# EasyEDA Pro project RadioFox1.eprj, schematic Schematic
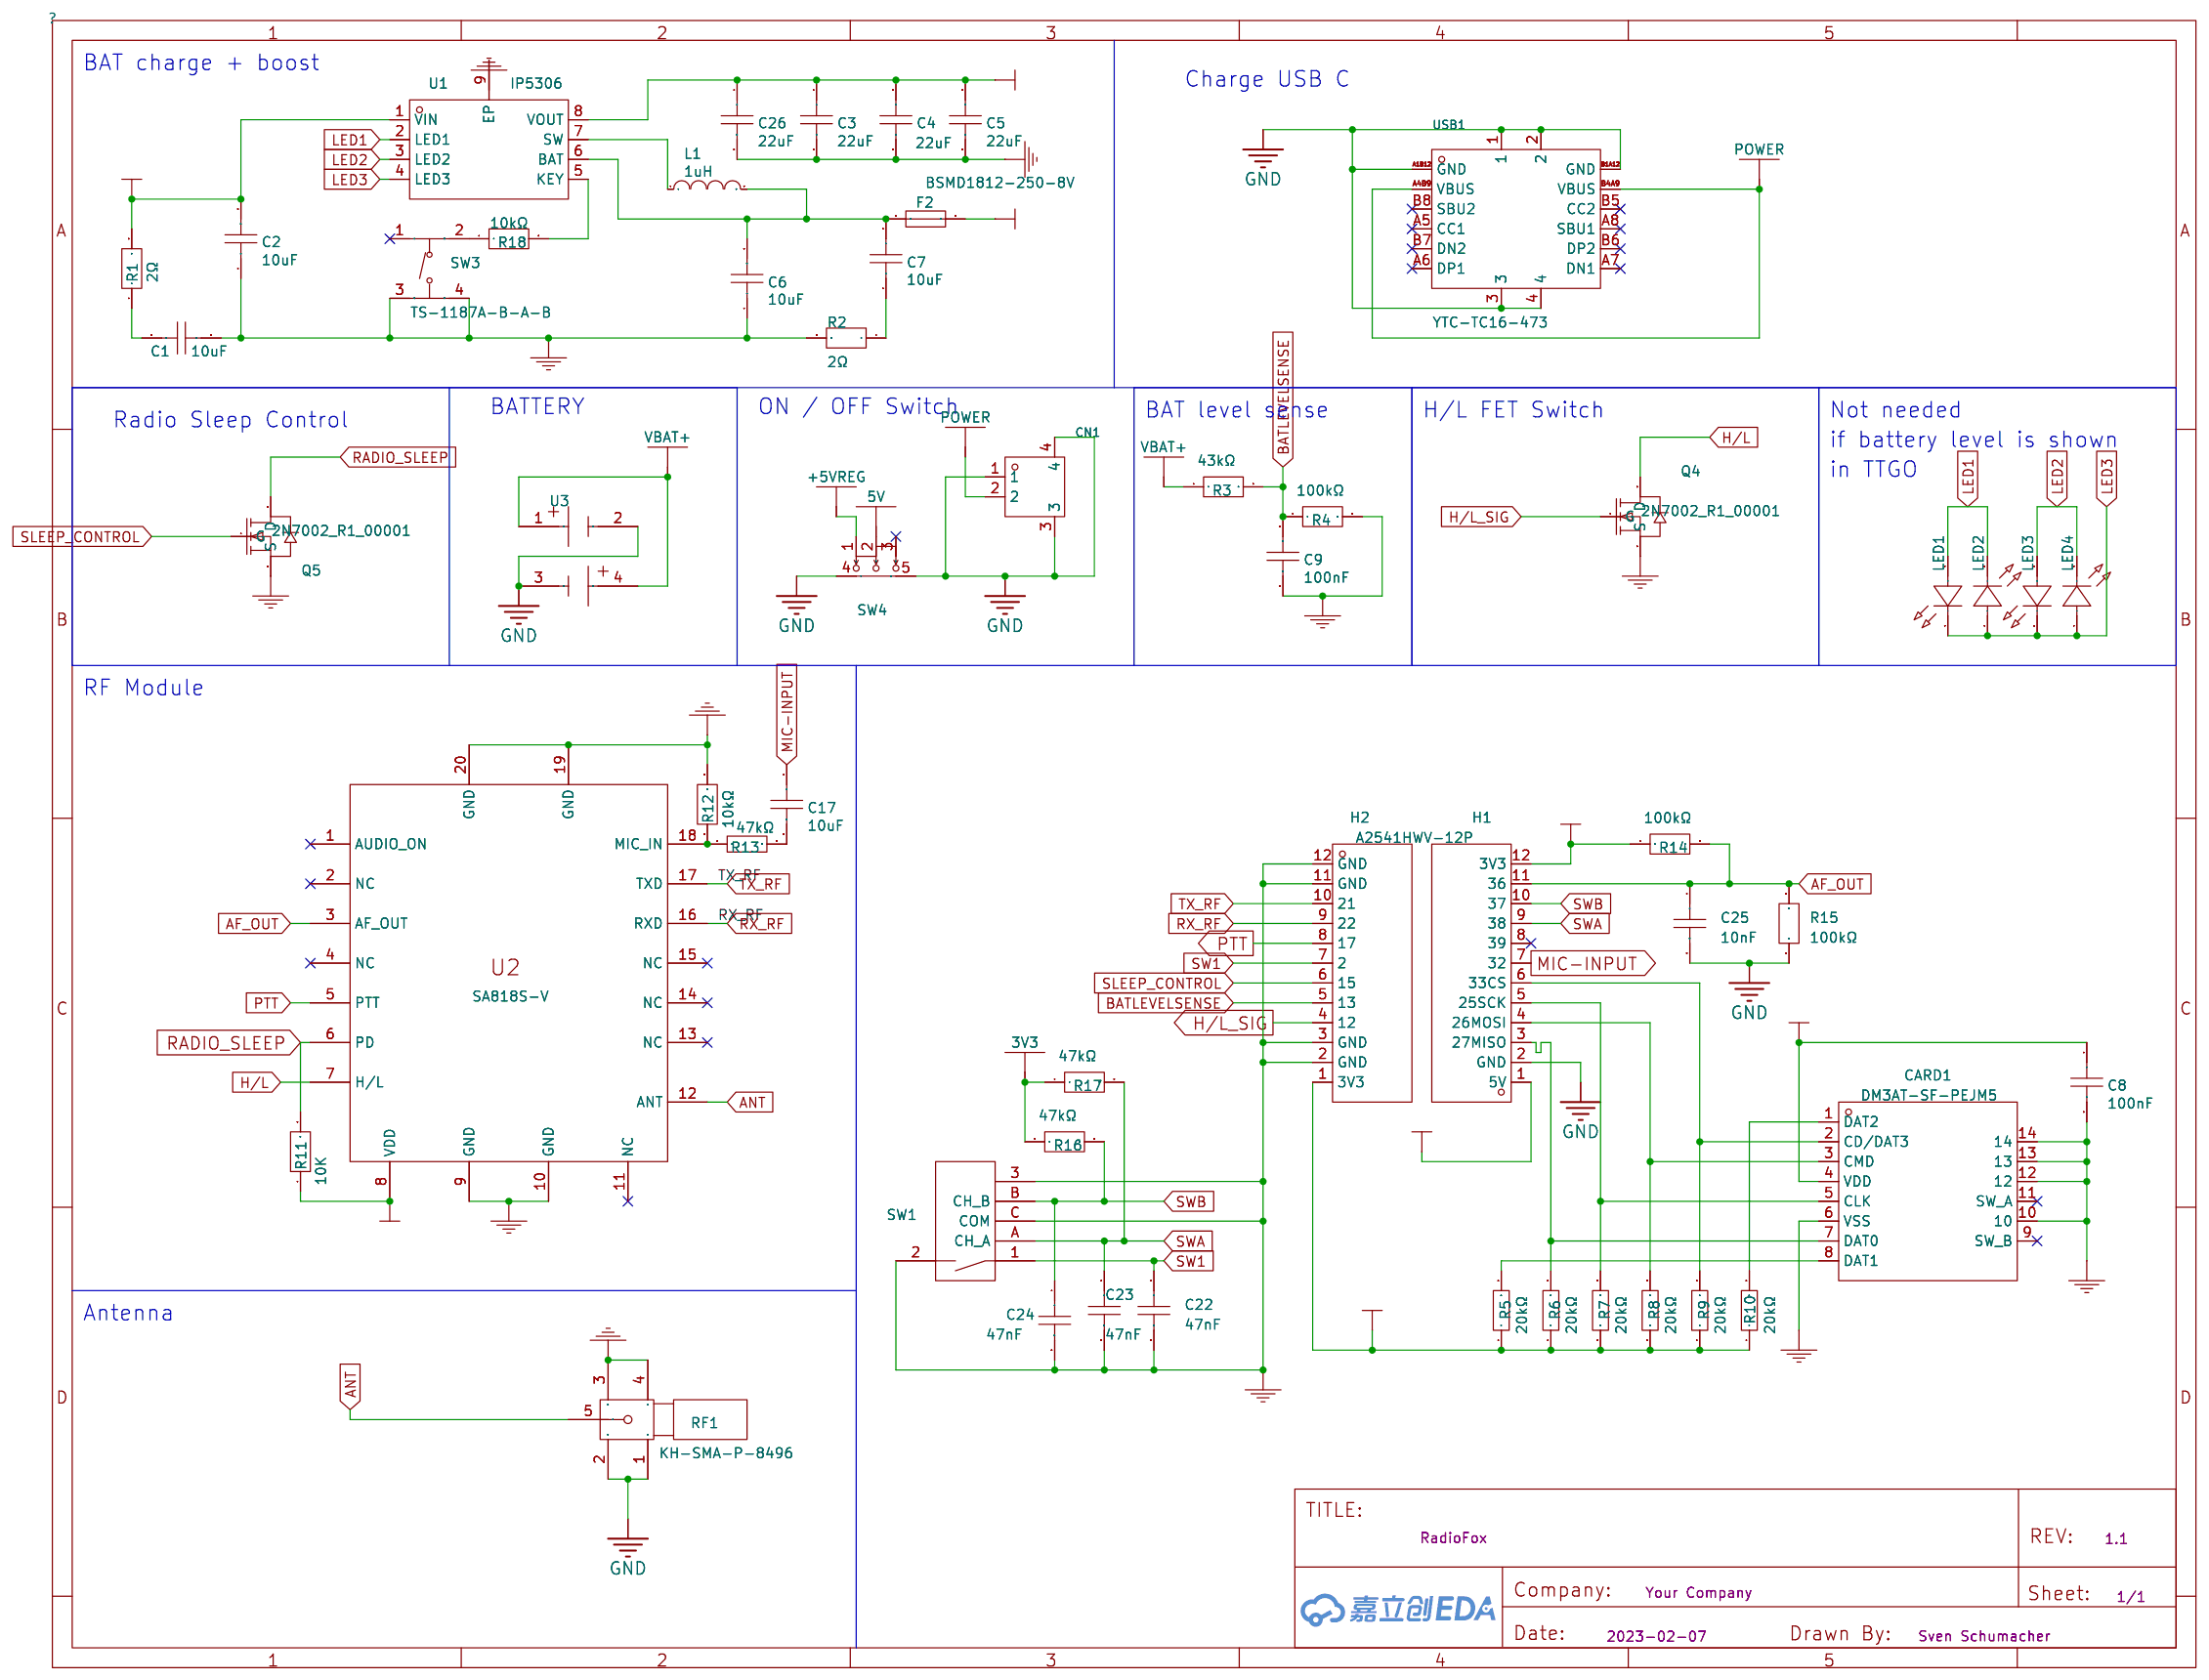
[diagram p1: schematic sheet]

## Parts
C1  10uF  [C1206]
C2  10uF  [C1206]
C3  22uF  [C1206]
C4  22uF  [C1206]
C5  22uF  [C1206]
C6  10uF  [C1206]
C7  10uF  [C1206]
C8  100nF  [C0603]
C9  100nF  [C0402]
C17  10uF  [C1206]
C22  47nF  [C0402]
C23  47nF  [C0402]
C24  47nF  [C0402]
C25  10nF  [C0402]
C26  22uF  [C1206]
CARD1  DM3AT-SF-PEJM5  [SD-SMD_DM3AT-SF-PEJM5]
CN1  PH2.0-2P-LT  [CONN-SMD_PH2.0-1X2PW]
F2  BSMD1812-250-8V  [F1812]
H1  A2541HWV-12P  [HDR-TH_12P-P2.54-V-F]
H2  A2541HWV-12P  [HDR-TH_12P-P2.54-V-F]
L1  1uH  [IND-SMD_L5.4-W5.1_SPM5020]
LED1  MHS171WDT-C2  [LED-SMD_L2.0-W1.1-R-RD-SIDE_WHITE]
LED2  MHS171WDT-C2  [LED-SMD_L2.0-W1.1-R-RD-SIDE_WHITE]
LED3  MHS171WDT-C2  [LED-SMD_L2.0-W1.1-R-RD-SIDE_WHITE]
LED4  MHS171WDT-C2  [LED-SMD_L2.0-W1.1-R-RD-SIDE_WHITE]
Q4  2N7002_R1_00001  [SOT-23-3_L2.9-W1.3-P1.90-LS2.4-BR]
Q5  2N7002_R1_00001  [SOT-23-3_L2.9-W1.3-P1.90-LS2.4-BR]
R1  2Ω  [R0402]
R2  2Ω  [R0402]
R3  43kΩ  [R0402]
R4  100kΩ  [R0402]
R5  20kΩ  [R0402]
R6  20kΩ  [R0402]
R7  20kΩ  [R0402]
R8  20kΩ  [R0402]
R9  20kΩ  [R0402]
R10  20kΩ  [R0402]
R11  10K  [R0402]
R12  10kΩ  [R0402]
R13  47kΩ  [R0402]
R14  100kΩ  [R0402]
R15  100kΩ  [R0402]
R16  47kΩ  [R0402]
R17  47kΩ  [R0402]
R18  10kΩ  [R0402]
RF1  KH-SMA-P-8496  [SMA-TH_KH-SMA-P-8496]
SW1  PEC11R-4220F-S0012  [SW-TH_PEC11R-4220F-S0012]
SW3  TS-1187A-B-A-B  [SW-SMD_4P-L5.1-W5.1-P3.70-LS6.5-TL-2]
SW4  SS-12D11L5  [SW-TH_SS-12D11L5]
U1  IP5306  [ESOP-8_L4.9-W3.9-P1.27-LS6.0-BL-EP]
U2  SA818S-V  [WIRELM-SMD_G-NICERF_SA818S-X]
U3  -  [BAT_1049P]
USB1  YTC-TC16-473  [USB-SMD_YTC-TC16-473]

## Library data of the parts
C1 C2 C6 C7 C17 = 1206F106Z160CT: Capacitance: Tolerance:-20%~+80% Tolerance:-20%~+80% Voltage Rated: Temperature Coefficient:; LCSC Part Name: 10uF -20%~+80% 16V; Supplier Part: C396769; Manufacturer: Walsin(华新科); Supplier Footprint: 1206; JLCPCB Part Class: Extended Part; Datasheet: https://atta.szlcsc.com/upload/public/pdf/source/20191217/C469650_84AD5C6F618CF4AC0C6D987F2E8FE6F8.pdf; Supplier: LCSC; Tolerance: -20%~+80%
C3-C5 C26 = CL31F226ZPHNNNE: Capacitance: Tolerance:-20%~+80% Tolerance:-20%~+80% Voltage Rated: Temperature Coefficient:; LCSC Part Name: 22uF -20%~+80% 10V; Supplier Part: C159749; Manufacturer: SAMSUNG(三星); Supplier Footprint: 1206; JLCPCB Part Class: Extended Part; Datasheet: https://atta.szlcsc.com/upload/public/pdf/source/20160218/1457707763339.pdf; Supplier: LCSC; Tolerance: -20%~+80%
C8 = CL10B104KC8NNNC: Capacitance: Tolerance:±10% Tolerance:±10% Voltage Rated: Temperature Coefficient:; LCSC Part Name: 100nF ±10% 100V; Supplier Part: C15725; Manufacturer: SAMSUNG(三星); Supplier Footprint: 0603; JLCPCB Part Class: Extended Part; Datasheet: https://atta.szlcsc.com/upload/public/pdf/source/20160218/1457707763339.pdf; Supplier: LCSC; Tolerance: ±10%
C9 = GRM155R71H104KE14D: Capacitance: Tolerance:±10% Tolerance:±10% Voltage Rated: Temperature Coefficient:; LCSC Part Name: 100nF ±10% 50V; Supplier Part: C77020; Manufacturer: muRata(村田); Supplier Footprint: 0402; JLCPCB Part Class: Extended Part; Datasheet: https://atta.szlcsc.com/upload/public/pdf/source/20180326/C77020_39BD49C951FF1AF0DB1F1FAC5AC1E401.pdf; Supplier: LCSC; Tolerance: ±10%
C22-C24 = CGA2B2X5R1E473K050BA: Capacitance: Voltage Rated: Temperature Coefficient:; LCSC Part Name: 47nF 25V; Supplier Part: C3889999; Manufacturer: TDK; Supplier Footprint: 0402; Supplier: LCSC
C25 = C1005X7R1H103KT000E: Capacitance: Tolerance:±10% Tolerance:±10% Voltage Rated: Temperature Coefficient:; LCSC Part Name: 10nF ±10% 50V; Supplier Part: C694170; Manufacturer: TDK; Supplier Footprint: 0402; JLCPCB Part Class: Extended Part; Datasheet: https://atta.szlcsc.com/upload/public/pdf/source/20191008/C432930_1569A900251E35B50161EFC1E9A1C511.pdf; Supplier: LCSC; Tolerance: ±10%
CARD1 = DM3AT-SF-PEJM5: Operating Temperature Range:- Operating Temperature Range:- Maximum Body Height:- Contact Plating:- Connector Type:卡座 Card Type:MicroSD卡(TF卡) Welding Temperature (Max):- Contact Material:- Card Connection Mode:自弹式; Supplier Part: C114218; Manufacturer: HRS(广濑); Supplier Footprint: SMD; JLCPCB Part Class: Extended Part; Datasheet: https://atta.szlcsc.com/upload/public/pdf/source/20170707/1499425911622.pdf; Supplier: LCSC; Connector Type: 卡座; Card Type: MicroSD卡(TF卡); Card Connection Mode: 自弹式
CN1 = PH2.0-2P-LT: Pins Structure:1x2P Pitch:2mm Mounting Style:Brick nogging Row Spacing:- Number of Pins:2P Number of Rows:1 Number of PINs Per Row:2 Reference Series:- Current Rating (Max):- Operating Temperature Range:- Operating Temperature Range:-; LCSC Part Name: 1x2P 间距:2mm 立贴; Supplier Part: C722761; Manufacturer: CAX(创都); Supplier Footprint: SMD,P=2mm; JLCPCB Part Class: Extended Part; Datasheet: https://atta.szlcsc.com/upload/public/pdf/source/20200902/C722761_7168BFE7362B0BB40E90E69EE754B0D4.pdf; Supplier: LCSC; Pins Structure: 1x2P; Pitch: 2mm; Mounting Style: Brick nogging; Number of Pins: 2P; Number of Rows: 1; Number of PINs Per Row: 2
F2 = BSMD1812-250-8V: Operating Voltage (Max):8V Current Rating (Max):40A Hold Current:2.5A Trip Current:5A Power Dissipation:1W Resistance - Initial (Ri) (Min):15mΩ Resistance - Post Trip (R1) (Max):80mΩ Maximum Time to Trip:2.5s Operating Temperature:-40℃~+85℃ Operating Temp; LCSC Part Name: 8V 2.5A 1812自恢复; Supplier Part: C960027; Manufacturer: BHFUSE(佰宏); Supplier Footprint: 1812; JLCPCB Part Class: Extended Part; Datasheet: https://atta.szlcsc.com/upload/public/pdf/source/20230512/6ED7FF50F668B3AF958C55F12246A840.pdf; Supplier: LCSC; Operating Voltage (Max): 8V; Current Rating (Max): 40A; Hold Current: 2.5A; Trip Current: 5A; Power Dissipation: 1W; Resistance - Initial (Ri) (Min): 15mΩ; Resistance - Post Trip (R1) (Max): 80mΩ; Maximum Time to Trip: 2.5s; Operating Temperature: -40℃~+85℃
H1 H2 = A2541HWV-12P_C225509: Holes Structure:1x12P Pitch:2.54mm Number of Holes:12P Mounting Type:Straight Number of Rows:Plugin Row Spacing:- Insulation Height:- Contact Material:Brass Contact Plating:Gold; LCSC Part Name: 间距:2.54mm 1x12P 直插 镀金; Supplier Part: C225509; Manufacturer: CJT(长江连接器); Supplier Footprint: 插件,P=2.54mm; JLCPCB Part Class: Extended Part; Datasheet: https://atta.szlcsc.com/upload/public/pdf/source/20180724/C239359_48B1BC0CA1B4E4396A63955AAFD15564.pdf; Supplier: LCSC; Holes Structure: 1x12P; Pitch: 2.54mm; Number of Holes: 12P; Mounting Type: Straight; Number of Rows: Plugin; Contact Material: Brass; Contact Plating: Gold
L1 = SPM5015T-1R0M-LR: Inductance:1uH Tolerance:±20% Tolerance:±20% Rated Current: Saturation Current (Isat):8A DC Resistance (DCR): Ratings:-; LCSC Part Name: 1uH ±20% 8A; Supplier Part: C1329923; Manufacturer: TDK; JLCPCB Part Class: Extended Part; Datasheet: https://atta.szlcsc.com/upload/public/pdf/source/20210504/3B0A5F43DE8E50BCA79661AE84368F94.pdf; Supplier: LCSC; Tolerance: ±20%; Saturation Current (Isat): 8A
LED1-LED4 = MHS171WDT-C2: Emitted Color:White Diode Configuration:- Forward Current:20mA Power Dissipation:75mW Lens Color:雾状黄透镜 Dominant Wavelength:- Dominant Wavelength:- Peak Wavelength:- Color Temperature:- Color Temperature:- Viewing Angle:140° Mounting Sytle:Side stickers Op; LCSC Part Name: 白灯 侧贴; Supplier Part: C693902; Manufacturer: MEIHUA(美华); Supplier Footprint: 0805; JLCPCB Part Class: Extended Part; Datasheet: https://atta.szlcsc.com/upload/public/pdf/source/20200629/C693902_02A5BBE949AE039B819496AC3C3652A5.pdf; Supplier: LCSC; Emitted Color: White; Forward Current: 20mA; Power Dissipation: 75mW; Lens Color: 雾状黄透镜; Viewing Angle: 140°; Mounting Sytle: Side stickers; Operating Temperature: -40℃~+85℃
Q4 Q5 = 2N7002_R1_00001: LCSC Part Name: 2N7002_R1 编带; Supplier Part: C282260; Manufacturer: PANJIT(强茂); Supplier Footprint: SOT-23; JLCPCB Part Class: Extended Part; Datasheet: https://atta.szlcsc.com/upload/public/pdf/source/20190315/C282260_ECC46E71D49323CDB96884DBCEBD7C5B.pdf; Supplier: LCSC
R1 R2 = ERJ2GEJ2R0X: Resistance: Tolerance:±5% Tolerance:±5% Power(Watts): Overload Voltage (Max): Temperature Coefficient:-100ppm/℃~+600ppm/℃ Temperature Coefficient:-100ppm/℃~+600ppm/℃ Type:Thick Film Resistors Operating Temperature Range:-55℃~+155℃ Operating Temperature Ra; LCSC Part Name: 2Ω ±5% 100mW 厚膜电阻; Supplier Part: C412896; Manufacturer: PANASONIC(松下); Supplier Footprint: 0402; JLCPCB Part Class: Extended Part; Datasheet: https://atta.szlcsc.com/upload/public/pdf/source/20190820/C412896_05BDC514AFCFC99B4922856BA77336DC.pdf; Supplier: LCSC; Tolerance: ±5%; Temperature Coefficient: -100ppm/℃~+600ppm/℃; Type: Thick Film Resistors; Operating Temperature Range: -55℃~+155℃; Resistance: 2
R3 = RC0402FR-0743KL: Type:Thick Film Resistors Resistance: Tolerance:±1% Tolerance:±1% Power(Watts): Temperature Coefficient:±100ppm/℃ Temperature Coefficient:±100ppm/℃ Overload Voltage (Max): Operating Temperature Range:-55℃~+155℃ Operating Temperature Range:-55℃~+155℃; LCSC Part Name: 43kΩ ±1% 62.5mW; Supplier Part: C185415; Manufacturer: YAGEO(国巨); Supplier Footprint: 0402; JLCPCB Part Class: Extended Part; Datasheet: https://atta.szlcsc.com/upload/public/pdf/source/20180316/DDE0832248D94F2163DA720CD31F3A32.pdf; Supplier: LCSC; Type: Thick Film Resistors; Tolerance: ±1%; Temperature Coefficient: ±100ppm/℃; Operating Temperature Range: -55℃~+155℃
R4 R14 R15 = RC0402FR-07100KL: Type:Thick Film Resistors Resistance: Tolerance:±1% Tolerance:±1% Power(Watts): Temperature Coefficient:±100ppm/℃ Temperature Coefficient:±100ppm/℃ Overload Voltage (Max): Operating Temperature Range:-55℃~+155℃ Operating Temperature Range:-55℃~+155℃; LCSC Part Name: 100kΩ ±1% 62.5mW; Supplier Part: C60491; Manufacturer: YAGEO(国巨); Supplier Footprint: 0402; JLCPCB Part Class: Extended Part; Datasheet: https://atta.szlcsc.com/upload/public/pdf/source/20170518/1495086055123.pdf; Supplier: LCSC; Type: Thick Film Resistors; Tolerance: ±1%; Temperature Coefficient: ±100ppm/℃; Operating Temperature Range: -55℃~+155℃
R5-R10 = RC0402FR-0720KL: Type:Thick Film Resistors Resistance: Tolerance:±1% Tolerance:±1% Power(Watts): Temperature Coefficient:±100ppm/℃ Temperature Coefficient:±100ppm/℃ Overload Voltage (Max): Operating Temperature Range:-55℃~+155℃ Operating Temperature Range:-55℃~+155℃; LCSC Part Name: 20kΩ ±1% 62.5mW; Supplier Part: C93942; Manufacturer: YAGEO(国巨); Supplier Footprint: 0402; JLCPCB Part Class: Extended Part; Datasheet: https://atta.szlcsc.com/upload/public/pdf/source/20171113/C93942_15105616763751116172.pdf; Supplier: LCSC; Type: Thick Film Resistors; Tolerance: ±1%; Temperature Coefficient: ±100ppm/℃; Operating Temperature Range: -55℃~+155℃; Resistance: 20K
R11 = Res_0402: Supplier Footprint: 0402; Supplier: LCSC; Supplier Part: C465721; Manufacturer: Viking(光颉); Manufacturer Part: AR03BTCX1002A; JLCPCB Part Class: Extended Part
R12 = RC0402FR-0710KL: Type:Thick Film Resistors Resistance: Tolerance:±1% Tolerance:±1% Power(Watts): Temperature Coefficient:±100ppm/℃ Temperature Coefficient:±100ppm/℃ Overload Voltage (Max): Operating Temperature Range:-55℃~+155℃ Operating Temperature Range:-55℃~+155℃; LCSC Part Name: 10kΩ ±1% 62.5mW; Supplier Part: C60490; Manufacturer: YAGEO(国巨); Supplier Footprint: 0402; JLCPCB Part Class: Extended Part; Datasheet: https://atta.szlcsc.com/upload/public/pdf/source/20170606/1496716515432.pdf; Supplier: LCSC; Type: Thick Film Resistors; Tolerance: ±1%; Temperature Coefficient: ±100ppm/℃; Operating Temperature Range: -55℃~+155℃; Resistance: 10K
R13 = RC0402FR-0747KL: Type:Thick Film Resistors Resistance: Tolerance:±1% Tolerance:±1% Power(Watts): Temperature Coefficient:±100ppm/℃ Temperature Coefficient:±100ppm/℃ Overload Voltage (Max): Operating Temperature Range:-55℃~+155℃ Operating Temperature Range:-55℃~+155℃; LCSC Part Name: 厚膜电阻 47kΩ ±1% 62.5mW; Supplier Part: C93943; Manufacturer: YAGEO(国巨); Supplier Footprint: 0402; JLCPCB Part Class: Extended Part; Datasheet: https://atta.szlcsc.com/upload/public/pdf/source/20180821/C275644_0D56F95EFF785E7D9A1FEF436B37DA78.pdf; Supplier: LCSC; Type: Thick Film Resistors; Tolerance: ±1%; Temperature Coefficient: ±100ppm/℃; Operating Temperature Range: -55℃~+155℃; Resistance: 47K
R16 R17 = MCR01MZPF4702: Type:Thick Film Resistors Resistance: Tolerance:±1% Tolerance:±1% Power(Watts): Overload Voltage (Max): Operating Temperature Range:-55℃~+155℃ Operating Temperature Range:-55℃~+155℃; LCSC Part Name: 47kΩ ±1% 63mW; Supplier Part: C2837787; Manufacturer: ROHM(罗姆); Supplier Footprint: 0402; JLCPCB Part Class: Extended Part; Datasheet: https://atta.szlcsc.com/upload/public/pdf/source/20210611/C2837787_27273297B8D4B82B8634919B2E115B73.pdf; Supplier: LCSC; Type: Thick Film Resistors; Tolerance: ±1%; Operating Temperature Range: -55℃~+155℃; Temperature Coefficient: ±100ppm/℃
R18 = RC0402FR-0710KL: Type:Thick Film Resistors Resistance: Tolerance:±1% Tolerance:±1% Power(Watts): Temperature Coefficient:±100ppm/℃ Temperature Coefficient:±100ppm/℃ Overload Voltage (Max): Operating Temperature Range:-55℃~+155℃ Operating Temperature Range:-55℃~+155℃; LCSC Part Name: 10kΩ ±1% 62.5mW; Supplier Part: C60490; Manufacturer: YAGEO(国巨); Supplier Footprint: 0402; JLCPCB Part Class: Extended Part; Datasheet: https://atta.szlcsc.com/upload/public/pdf/source/20170606/1496716515432.pdf; Supplier: LCSC; Type: Thick Film Resistors; Tolerance: ±1%; Temperature Coefficient: ±100ppm/℃; Operating Temperature Range: -55℃~+155℃
RF1 = KH-SMA-P-8496: Connector Type:板端 Interface Type:内孔 Frequency-Max:- Interface Diameter:5.25mm RF Series:SMA Number of Ports:1 Impedance:- Style:弯头 Interface Length/Height:11mm Operating Temperature Range:- Operating Temperature Range:-; LCSC Part Name: SMA 内孔 弯头 镀金外螺内孔,11牙(三件套); Supplier Part: C910123; Manufacturer: kinghelm(金航标); Supplier Footprint: 插件; JLCPCB Part Class: Extended Part; Datasheet: https://atta.szlcsc.com/upload/public/pdf/source/20210317/C910123_D9C544C7B464C90B55B8BB4FC6044180.pdf; Supplier: LCSC; Connector Type: 板端; Interface Type: 内孔; Interface Diameter: 5.25mm; RF Series: SMA; Number of Ports: 1; Style: 弯头; Interface Length/Height: 11mm
SW1 = PEC11R-4220F-S0012: LCSC Part Name: PEC11R-4220F-S0012（三件套）; Supplier Part: C143817; Manufacturer: BOURNS; Supplier Footprint: 插件; JLCPCB Part Class: Extended Part; Datasheet: https://atta.szlcsc.com/upload/public/pdf/source/20171128/C143817_15118626936631147315.pdf; Supplier: LCSC
SW3 = TS-1187A-B-A-B: Contact Current:50mA Voltage Rating (DC):12V Insulation Resistance:- Circuit:SPST Mounting Style:Brick nogging Actuator Style:Round Button Actuator/Cap Color:金色 With Lamp:No Operating Force:160gf Mechanical Life:100000次 Operating Temperature:-30℃~+85℃ Ope; LCSC Part Name: 5.1*5.1*1.5mm 立贴 轻触开关 防水金属头; Supplier Part: C318884; Manufacturer: XKB Connectivity(中国星坤); Supplier Footprint: SMD; JLCPCB Part Class: Basic Part; Datasheet: https://atta.szlcsc.com/upload/public/pdf/source/20200227/C318884_1F20165719E1C4CAA3E10C4C359C6E26.pdf; Supplier: LCSC; Contact Current: 50mA; Voltage Rating (DC): 12V; Circuit: SPST; Mounting Style: Brick nogging; Actuator Style: Round Button; Actuator/Cap Color: 金色; With Lamp: No; Operating Force: 160gf; Mechanical Life: 100000次; Operating Temperature: -30℃~+85℃; Switch Length: 5.1mm; Switch Width: 5.1mm; Switch Height: 1.5mm; Strike Gundam: NO
SW4 = SS-12D11L5: Current Rating (DC):3A Voltage Rating (DC):125V Current Rating (AC):3A Voltage Rating (AC):125V Circuit:SPDT Mounting Style:Lying Mechanical Life:10000次 Actuator Color:Black Actuator Style:Rectangular columnar Pin Style:PCPin Operating Temperature:-40℃~+8; LCSC Part Name: 柄长5mm 卧插双档 滑动开关; Supplier Part: C319010; Manufacturer: XKB Connectivity(中国星坤); Supplier Footprint: 插件; JLCPCB Part Class: Extended Part; Datasheet: https://atta.szlcsc.com/upload/public/pdf/source/20211009/84F89DEF741E27E9E55DE4039DC07CAD.pdf; Supplier: LCSC; Current Rating (DC): 3A; Voltage Rating (DC): 125V; Current Rating (AC): 3A; Voltage Rating (AC): 125V; Circuit: SPDT; Mounting Style: Lying; Mechanical Life: 10000次; Actuator Color: Black; Actuator Style: Rectangular columnar; Pin Style: PCPin; Operating Temperature: -40℃~+85℃; Switch Length: 13.5mm; Switch Width: 6.6mm; Switch Height: 6.3mm
U1 = IP5306: Supplier Part: C181692; Manufacturer: INJOINIC(英集芯); Supplier Footprint: SOP-8-EP; JLCPCB Part Class: Extended Part; Datasheet: https://atta.szlcsc.com/upload/public/pdf/source/20190627/C384572_9925B3DDC4041BC6108E5AB46A2A0AB1.pdf; Supplier: LCSC
U2 = SA818S-U: LCSC Part Name: 对讲机模块; Manufacturer: G-NiceRF(思为无线); Supplier Footprint: SMD,19x35.6mm; JLCPCB Part Class: Extended Part; Datasheet: https://atta.szlcsc.com/upload/public/pdf/source/20220425/87B569942CB193BEE2E666898149E81A.pdf; Supplier: NiceRF.com
U3 = 1049P: Supplier: digikey.com; Manufacturer: Keystone Electronics
USB1 = YTC-TC16-473: Connector Type:Type-C Gender:Female; LCSC Part Name: Type-C 母; Supplier Part: C5329561; Manufacturer: YIYUAN(怡远); Supplier Footprint: SMD; JLCPCB Part Class: Extended Part; Datasheet: https://atta.szlcsc.com/upload/public/pdf/source/20230511/D79585C2033D5D456444CA5D40A6458A.pdf; Supplier: LCSC; Connector Type: Type-C; Gender: Female

## Nets
3V3: C8.1 CARD1.4(VDD) H1.12(3V3) H2.1(3V3) R5.1 R6.1 R7.1 R8.1 R9.1 R10.1 R14.1 R16.1 R17.1
5V: H1.1(5V) R11.1 SW4.2 U2.8(VDD)
+5VREG: C3.1 C4.1 C5.1 C26.1 SW4.1 U1.8(VOUT)
GND: C1.1 C2.1 C3.2 C4.2 C5.2 C6.1 C8.2 C9.1 C22.2 C23.2 C24.2 C25.2 C26.2 CARD1.6(VSS) CARD1.10 CARD1.12 CARD1.13 CARD1.14 CN1.1 CN1.3 CN1.4 H1.2(GND) H2.2(GND) H2.3(GND) H2.11(GND) H2.12(GND) Q4.2(S) Q5.2(S) R2.2 R4.2 R12.2 R15.1 RF1.5 SW1.2 SW1.3 SW1.C(COM) SW3.3(C) SW3.4(D) SW4.4 SW4.5 U1.9(EP) U2.9(GND) U2.10(GND) U2.19(GND) U2.20(GND) U3.2(N1) U3.3(N2) USB1.1 USB1.2 USB1.3 USB1.4 USB1.A1B12(GND) USB1.B1A12(GND)
VBAT+: F2.2 R3.1 U3.1(P1) U3.4(P2)
AF_OUT: C25.1 H1.11(36) R14.2 R15.2 U2.3(AF_OUT)
ANT: U2.12(ANT)
BATLEVELSENSE: C9.2 H2.5(13) R3.2 R4.1
H/L: Q4.3(D) U2.7(H/L)
H/L_SIG: H2.4(12) Q4.1(G)
LED1: LED1.1(+) LED2.2(-) U1.2(LED1)
LED2: LED3.1(+) LED4.2(-) U1.3(LED2)
LED3: LED1.2(-) LED2.1(+) LED3.2(-) LED4.1(+) U1.4(LED3)
MIC-INPUT: C17.1 H1.7(32)
POWER: C2.2 CN1.2 R1.2 U1.1(VIN) USB1.A4B9(VBUS) USB1.B4A9(VBUS)
PTT: H2.8(17) U2.5(PTT)
RADIO_SLEEP: Q5.3(D) R11.2 U2.6(PD)
RX_RF: H2.9(22) U2.16(RXD)
SLEEP_CONTROL: H2.6(15) Q5.1(G)
SW1: C22.1 H2.7(2) SW1.1
SWA: C23.1 H1.9(38) R17.2 SW1.A(CH)
SWB: C24.1 H1.10(37) R16.2 SW1.B(CH)
TX_RF: H2.10(21) U2.17(TXD)
$1N118: CARD1.7(DAT0) H1.3(27MISO) R6.2
$1N119: CARD1.3(CMD) H1.4(26MOSI) R8.2
$1N120: CARD1.5(CLK) H1.5(25SCK) R7.2
$1N121: CARD1.8(DAT1) R5.2
$1N122: CARD1.2(CD/DAT3) H1.6(33CS) R9.2
$1N123: CARD1.1(DAT2) R10.2
$1N921: C1.2 R1.1
$1N930: R12.1 R13.1 U2.18(MIC_IN)
$1N934: C17.2 R13.2
$1N9497: C7.1 R2.1
$1N10454: L1.1 U1.7(SW)
$1N10458: C6.2 C7.2 F2.1 L1.2 U1.6(BAT)
$1N33469: R18.1 SW3.2(B)
$1N33473: R18.2 U1.5(KEY)

Not connected (* = marked no-connect by the designer): CARD1 9(SW_B)* 11(SW_A)*; H1 8(39)*; RF1 1 2 3 4; SW3 1(A)*; SW4 3*; U2 1(AUDIO_ON)* 2(NC)* 4(NC)* 11(NC)* 13(NC)* 14(NC)* 15(NC)*; USB1 A5(CC1)* A6(DP1)* A7(DN1)* A8(SBU1)* B5(CC2)* B6(DP2)* B7(DN2)* B8(SBU2)*

## Notes on the sheet
- BAT charge + boost
- Charge USB C
- BATTERY
- ON / OFF Switch
- BAT level sense
- H/L FET Switch
- Not needed
- Radio Sleep Control
- if battery level is shown
- in TTGO
- RF Module
- Antenna
